# EasyEDA schematic smart switch_2021-06-13.json
TITLE: SMART_SWITCH; REV: 1.0; Date: 2021-06-13; Sheet: 1/1; Drawn By: vakeesank99
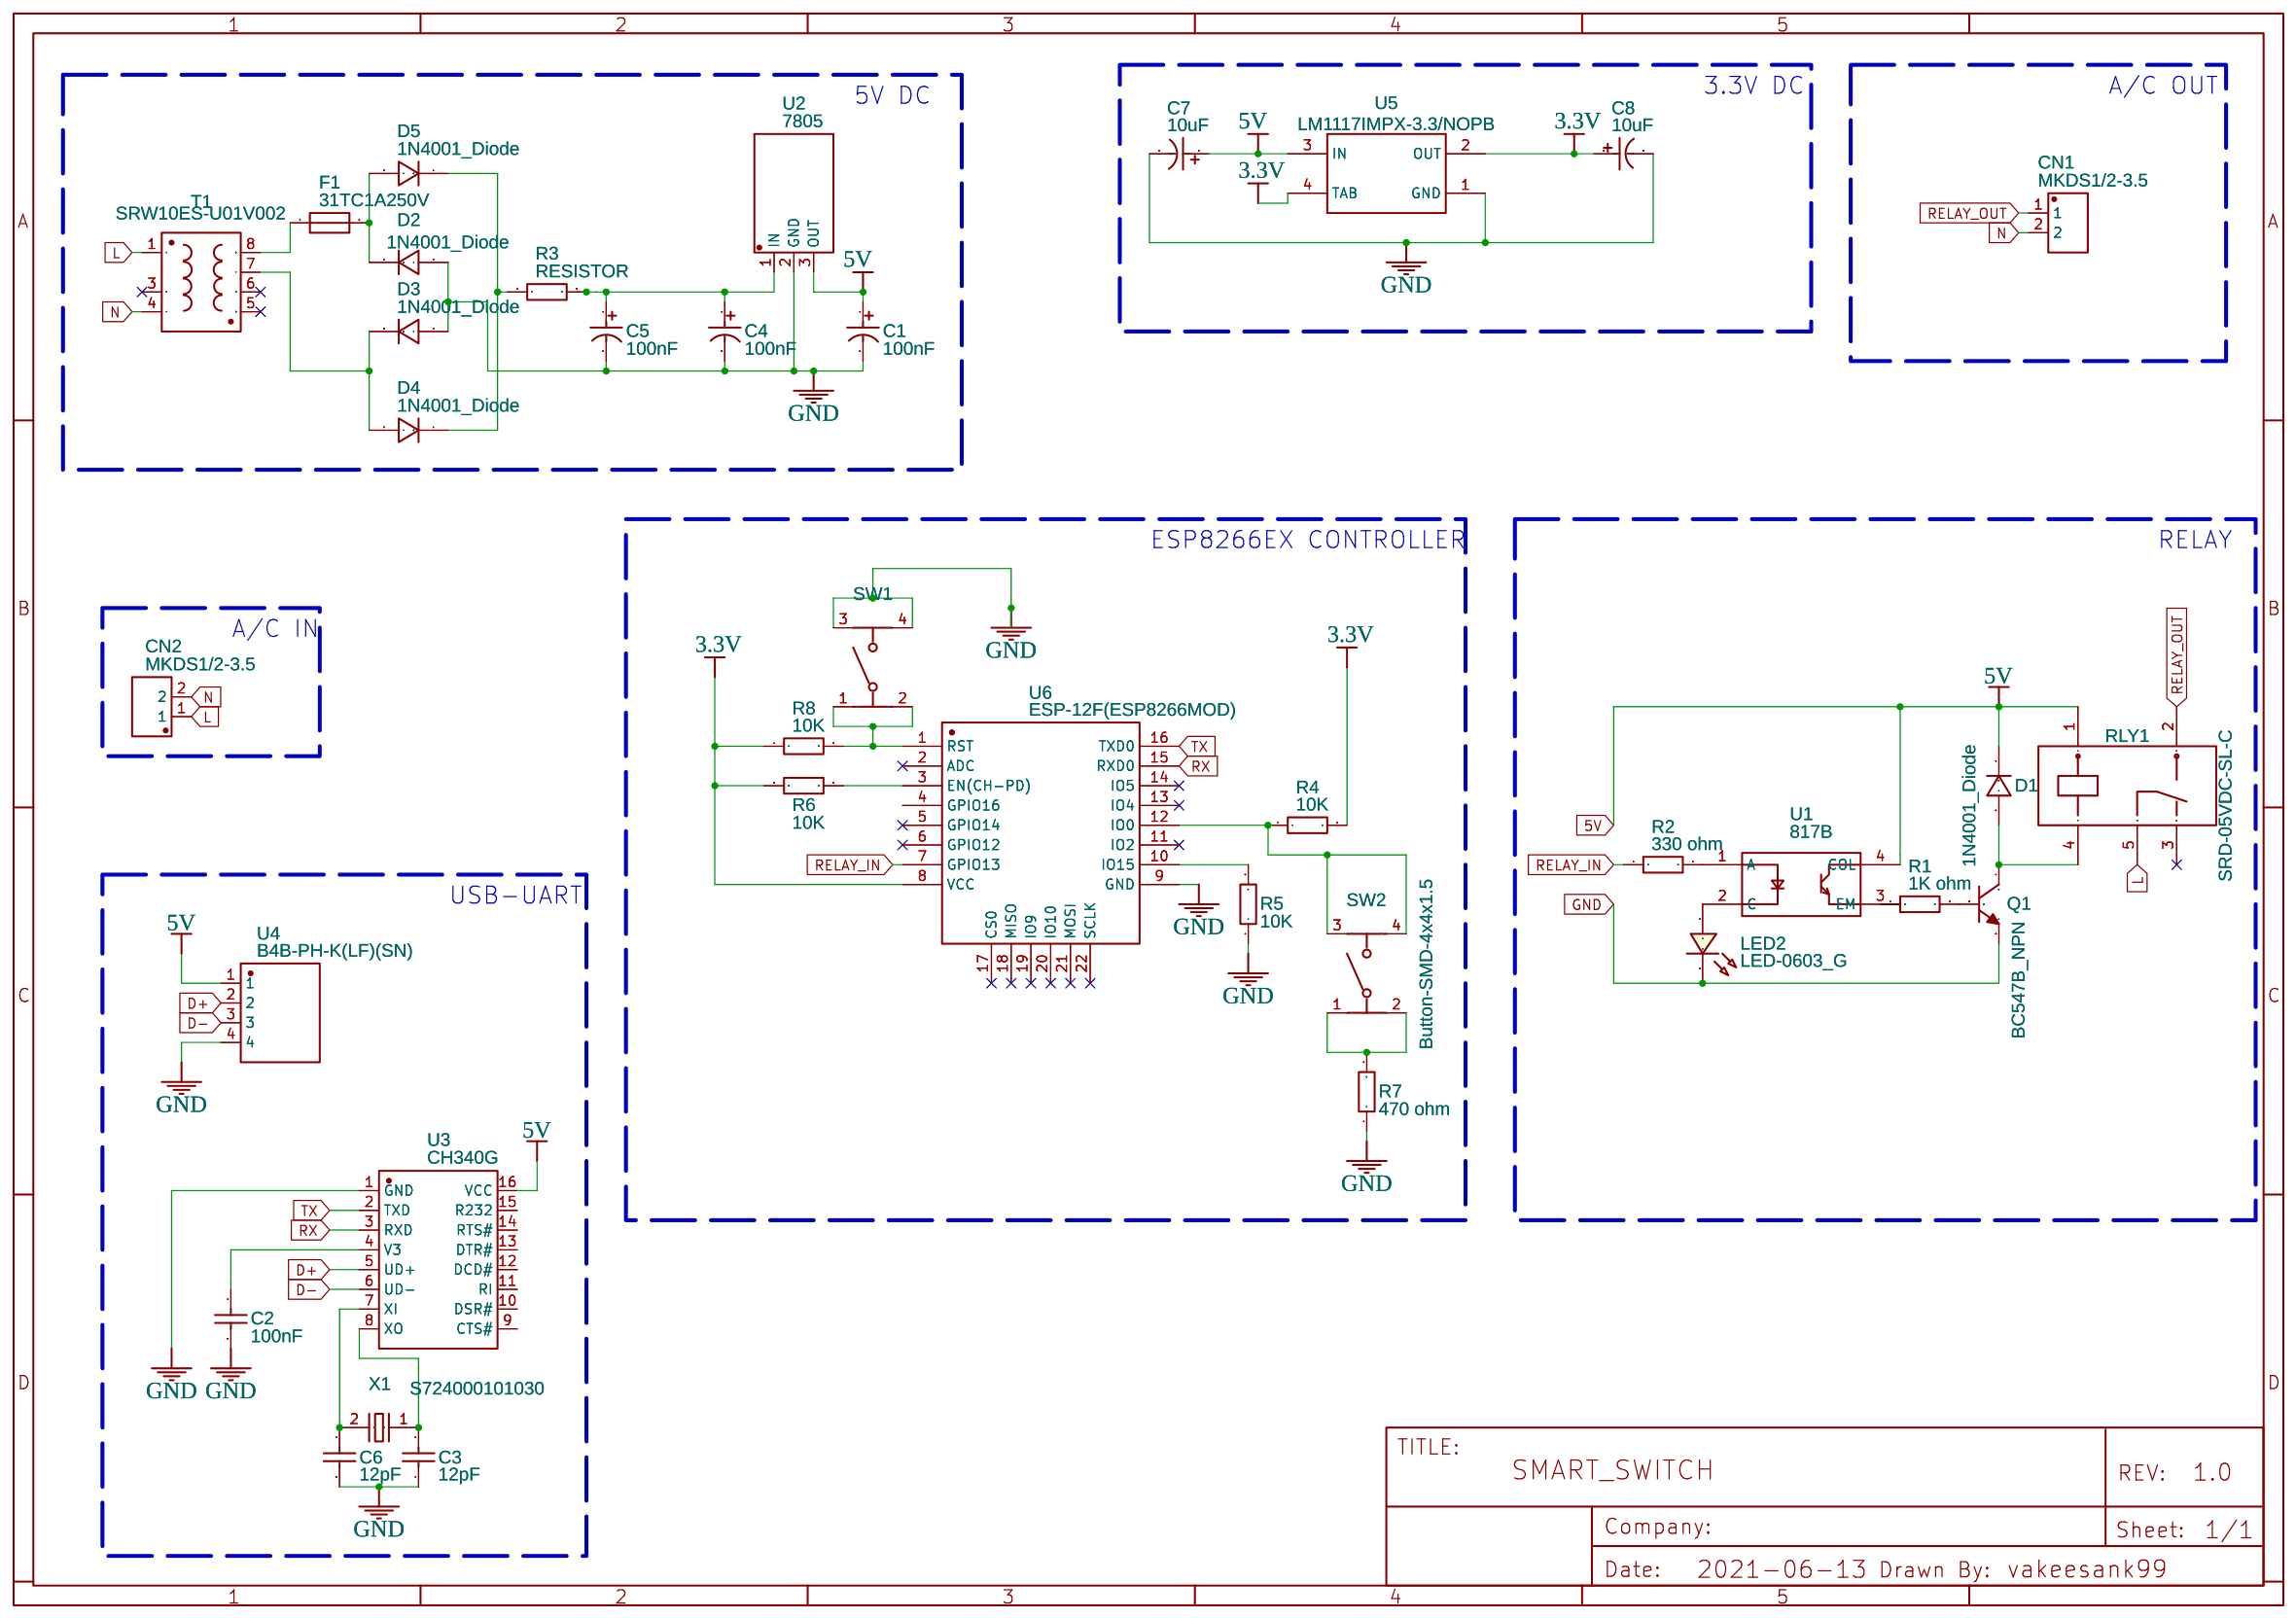
[diagram p0: schematic sheet]

## Parts
C1  100nF  [CAP-TH_BD5.0-P2.00-D0.8-FD]
C2  100nF  [RAD-0.2]
C3  12pF  [C0805]
C4  100nF  [CAP-TH_BD5.0-P2.00-D0.8-FD]
C5  100nF  [CAP-TH_BD5.0-P2.00-D0.8-FD]
C6  12pF  [C0805]
C7  10uF  [CAP-TH_BD5.0-P2.00-D0.8-FD]
C8  10uF  [CAP-TH_BD5.0-P2.00-D0.8-FD]
CN1  MKDS1/2-3.5  [CONN-TH_MKDS1-2-3.5]
CN2  MKDS1/2-3.5  [CONN-TH_MKDS1-2-3.5]
D1  1N4001_Diode  [DO-41_BD2.4-L4.7-P8.70-D0.9-RD]
D2  1N4001_Diode  [DO-41_BD2.4-L4.7-P8.70-D0.9-RD]
D3  1N4001_Diode  [DO-41_BD2.4-L4.7-P8.70-D0.9-RD]
D4  1N4001_Diode  [DO-41_BD2.4-L4.7-P8.70-D0.9-RD]
D5  1N4001_Diode  [DO-41_BD2.4-L4.7-P8.70-D0.9-RD]
F1  31TC1A250V  [FUSE-TH_BD4.0-L11.0-P15.00-D0.6]
LED2  LED-0603_G  [LED0603_GREEN]
Q1  BC547B_NPN  [TO-92-3_L4.9-W3.7-P1.27-L]
R1  1K ohm  [AXIAL-0.4]
R2  330 ohm  [AXIAL-0.4]
R3  RESISTOR  [AXIAL-0.4]
R4  10K  [R0402]
R5  10K  [R0402]
R6  10K  [R0402]
R7  470 ohm  [R0402]
R8  10K  [R0402]
RLY1  SRD-05VDC-SL-C  [RELAY-TH_SRD-XXVDC-XL-C]
SW1  Button-SMD-4x4x1.5  [SW-SMD_4P-L5.2-W5.2-P3.70-LS6.5]
SW2  Button-SMD-4x4x1.5  [SW-SMD_4P-L5.2-W5.2-P3.70-LS6.5]
T1  SRW10ES-U01V002  [IND-TH_7P-L11.4-W11.0-P2.50-D0.5-S8.00]
U1  817B  [DIP-4_L4.6-W6.5-P2.54-LS7.6-BL]
U2  7805  [TO-220-3_L10.0-W4.5-P2.54-L]
U3  CH340G  [SOIC-16_L9.9-W3.9-P1.27-LS6.0-BR]
U4  B4B-PH-K(LF)(SN)  [CONN-TH_B4B-PH-K-LF-SN]
U5  LM1117IMPX-3.3/NOPB  [SOT-223_L6.5-W3.5-P2.30-LS7.0-BR]
U6  ESP-12F(ESP8266MOD)  [WIFIM-SMD_ESP-12F-ESP8266MOD]
X1  S724000101030  [CRYSTAL-SMD_L7.0-W4.1-BL]

## Library data of the parts
C1 C4 C5 = 0.1uF: Supplier: LCSC; Manufacturer: ValuePro; Manufacturer Part: 0.1UF 50V; Supplier Part: C28061; JLCPCB Part Class: Extended Part
C2 = 100nF: Supplier: LCSC; Manufacturer: LCSC; Manufacturer Part: 0.1UF(104) +-20% 63v; Supplier Part: C19355
C3 C6 = 0805CG120J500NT_C38142: Supplier: LCSC; Manufacturer: FH; Manufacturer Part: 0805CG120J500NT; Supplier Part: C38142
C7 C8 = 10uF 16V 5*11: Supplier: LCSC; Manufacturer: ValuePro; Supplier Part: C43799; JLCPCB Part Class: Extended Part
CN1 CN2 = MKDS1/2-3.5: Supplier: LCSC; Manufacturer: Phoenix Contact; Supplier Part: C89122; JLCPCB Part Class: Extended Part
D1-D5 = 1N4001_Diode: Supplier: LCSC; Supplier Part: C99656; Manufacturer: Diodes Incorporated; Manufacturer Part: 1N4001-T; Contributor: LCSC; JLCPCB Part Class: Extended Part
F1 = 31TC1A250V: Supplier: LCSC; Supplier Part: C529652; Manufacturer: Hongda; Contributor: LCSC; JLCPCB Part Class: Extended Part
LED2 = LED-0603_G: Manufacturer: EVERLIGHT(台湾亿光); Manufacturer Part: 19-217/GHC-YR1S2/3T; Supplier Part: C72043; Supplier: LCSC; Contributor: LCEDA_Lib
Q1 = BC547B_NPN_Transistor: Supplier: LCSC; Supplier Part: C713613; Manufacturer: LGE; Manufacturer Part: BC547B; Contributor: LCSC; JLCPCB Part Class: Extended Part
R1-R3 = RESISTOR: Power: 1/4W; Tolerance: ±1%; EasyEDA: E57439; Supplier Part: E57439; Supplier: EasyEDA; Manufacturer: UniOhm; Manufacturer Part: MFR0W4F2200A50
R4-R8 = TR0402D10KQ1025: Supplier: LCSC; Supplier Part: C149898; Manufacturer: Ever Ohms Tech; Contributor: LCSC; JLCPCB Part Class: Extended Part
RLY1 = SRD-05VDC-SL-C: Supplier: LCSC; Manufacturer: SONGLE; Supplier Part: C35449; JLCPCB Part Class: Extended Part
SW1 SW2 = Button-SMD-4x4x1.5: Supplier Part: C71830; Supplier: LCSC; Manufacturer: BBJ; Manufacturer Part: 4*4*1.5Copper head,260G, 0.25mm,
T1 = SRW10ES-U01V002: Supplier: LCSC; Supplier Part: C433047; Manufacturer: TDK; Contributor: LCSC; JLCPCB Part Class: Extended Part
U1 = 817B: Supplier: LCSC; Supplier Part: C695830; Manufacturer: UMW(Youtai Semiconductor Co., Ltd.); Contributor: LCSC; JLCPCB Part Class: Extended Part
U2 = 7805: Supplier: LCSC; Supplier Part: C305416; Manufacturer: Foshan Blue Rocket Elec; Contributor: LCSC; JLCPCB Part Class: Extended Part
U3 = CH340G: Supplier: LCSC; Manufacturer: WCH; Supplier Part: C14267; JLCPCB Part Class: Basic Part
U4 = B4B-PH-K(LF)(SN): Supplier: LCSC; Supplier Part: C265289; Manufacturer: JST Sales America; Contributor: LCSC; JLCPCB Part Class: Extended Part
U5 = LM1117IMPX-3.3/NOPB: Supplier: LCSC; Manufacturer: TI; Supplier Part: C23984; JLCPCB Part Class: Extended Part
U6 = ESP-12F(ESP8266MOD): Supplier: LCSC; Manufacturer: Ai-Thinker; Supplier Part: C82891; JLCPCB Part Class: Extended Part
X1 = S724000101030: Supplier: LCSC; Supplier Part: C555584; Manufacturer: JGHC(晶光华); JLCPCB Part Class: Extended Part; Contributor: LCSC

## Nets
3.3V: C8.1 R4.2 R6.2 R8.1 U5.2(OUT) U5.4(TAB) U6.8(VCC)
5V: C1.1 C7.1 D1.1(C) RLY1.1 U1.4(COL) U2.3(OUT) U3.16(VCC) U4.1 U5.3(IN)
GND: C1.2 C2.2 C3.1 C4.2 C5.2 C6.1 C7.2 C8.2 D2.2(A) D3.2(A) LED2.2 Q1.3(E) R5.1 R7.1 SW1.3 SW1.4 U2.2(GND) U3.1(GND) U4.4 U5.1(GND) U6.9(GND)
D+: U3.5(UD+) U4.2
D-: U3.6(UD-) U4.3
L: CN2.1 RLY1.5 T1.1
N: CN1.2 CN2.2 T1.4
RELAY_IN: R2.1 U6.7(GPIO13)
RELAY_OUT: CN1.1 RLY1.2
RX: U3.3(RXD) U6.15(RXD0)
TX: U3.2(TXD) U6.16(TXD0)
Net-(C2-1): C2.1 U3.4(V3)
Net-(C3-2): C3.2 U3.8(XO) X1.1
Net-(C4-1): C4.1 C5.1 R3.2 U2.1(IN)
Net-(C6-2): C6.2 U3.7(XI) X1.2(GND)
Net-(D1-2): D1.2(A) Q1.1(C) RLY1.4
Net-(D2-1): D2.1(C) D5.2(A) F1.2
Net-(D3-1): D3.1(C) D4.2(A) T1.7
Net-(D4-1): D4.1(C) D5.1(C) R3.1
Net-(F1-1): F1.1 T1.8
Net-(LED2-1): LED2.1 U1.2(C)
Net-(Q1-2): Q1.2(B) R1.2
Net-(R1-1): R1.1 U1.3(EM)
Net-(R2-2): R2.2 U1.1(A)
Net-(R4-1): R4.1 SW2.3 SW2.4 U6.12(IO0)
Net-(R5-2): R5.2 U6.10(IO15)
Net-(R6-1): R6.1 U6.3(EN(CH-PD))
Net-(R7-2): R7.2 SW2.1 SW2.2
Net-(R8-2): R8.2 SW1.1 SW1.2 U6.1(RST)

Not connected (* = marked no-connect by the designer): RLY1 3*; T1 3* 5* 6*; U3 9(CTS#) 10(DSR#) 11(RI) 12(DCD#) 13(DTR#) 14(RTS#) 15(R232); U6 2(ADC)* 4(GPIO16) 5(GPIO14)* 6(GPIO12)* 11(IO2)* 13(IO4)* 14(IO5)* 17(CS0)* 18(MISO)* 19(IO9)* 20(IO10)* 21(MOSI)* 22(SCLK)*

## Notes on the sheet
- 5V DC
- 3.3V DC
- A/C OUT
- ESP8266EX CONTROLLER
- RELAY
- A/C IN
- USB-UART
